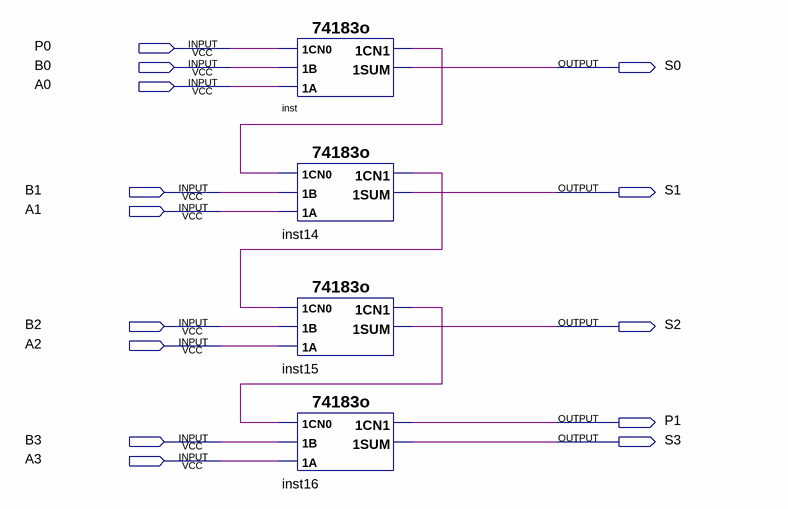
[diagram p0: schematic sheet]
// Quartus schematic project2.bdf as structural Verilog: 4 symbols, 14 pins
module project2 (
  input  P0,
  input  B0,
  input  A0,
  input  B1,
  input  A1,
  input  B2,
  input  A2,
  input  B3,
  input  A3,
  output S0,
  output S1,
  output S2,
  output P1,
  output S3
);

  wire inst14_1cn1, inst15_1cn1, inst_1cn1;

  \74183o  inst (.\1CN0 (P0), .\1A (A0), .\1B (B0), .\1CN1 (inst_1cn1), .\1SUM (S0));
  \74183o  inst14 (.\1CN0 (inst_1cn1), .\1A (A1), .\1B (B1), .\1CN1 (inst14_1cn1), .\1SUM (S1));
  \74183o  inst15 (.\1CN0 (inst14_1cn1), .\1A (A2), .\1B (B2), .\1CN1 (inst15_1cn1), .\1SUM (S2));
  \74183o  inst16 (.\1CN0 (inst15_1cn1), .\1A (A3), .\1B (B3), .\1CN1 (P1), .\1SUM (S3));
endmodule
